# EasyEDA Pro project ProPrj_M0G3507小车_2025-04-02 2025-7-14 232358 6.epro

# Schematic M0G3507电赛控制板
Create Date: 2024-07-20; Page Name: P1; Project Name: M0G3507小车; Schematic Name: M0G3507电赛控制板; Update Date: 2024-07-22; Company: 嘉立创EDA; Page Size: A4; Version: V1.0
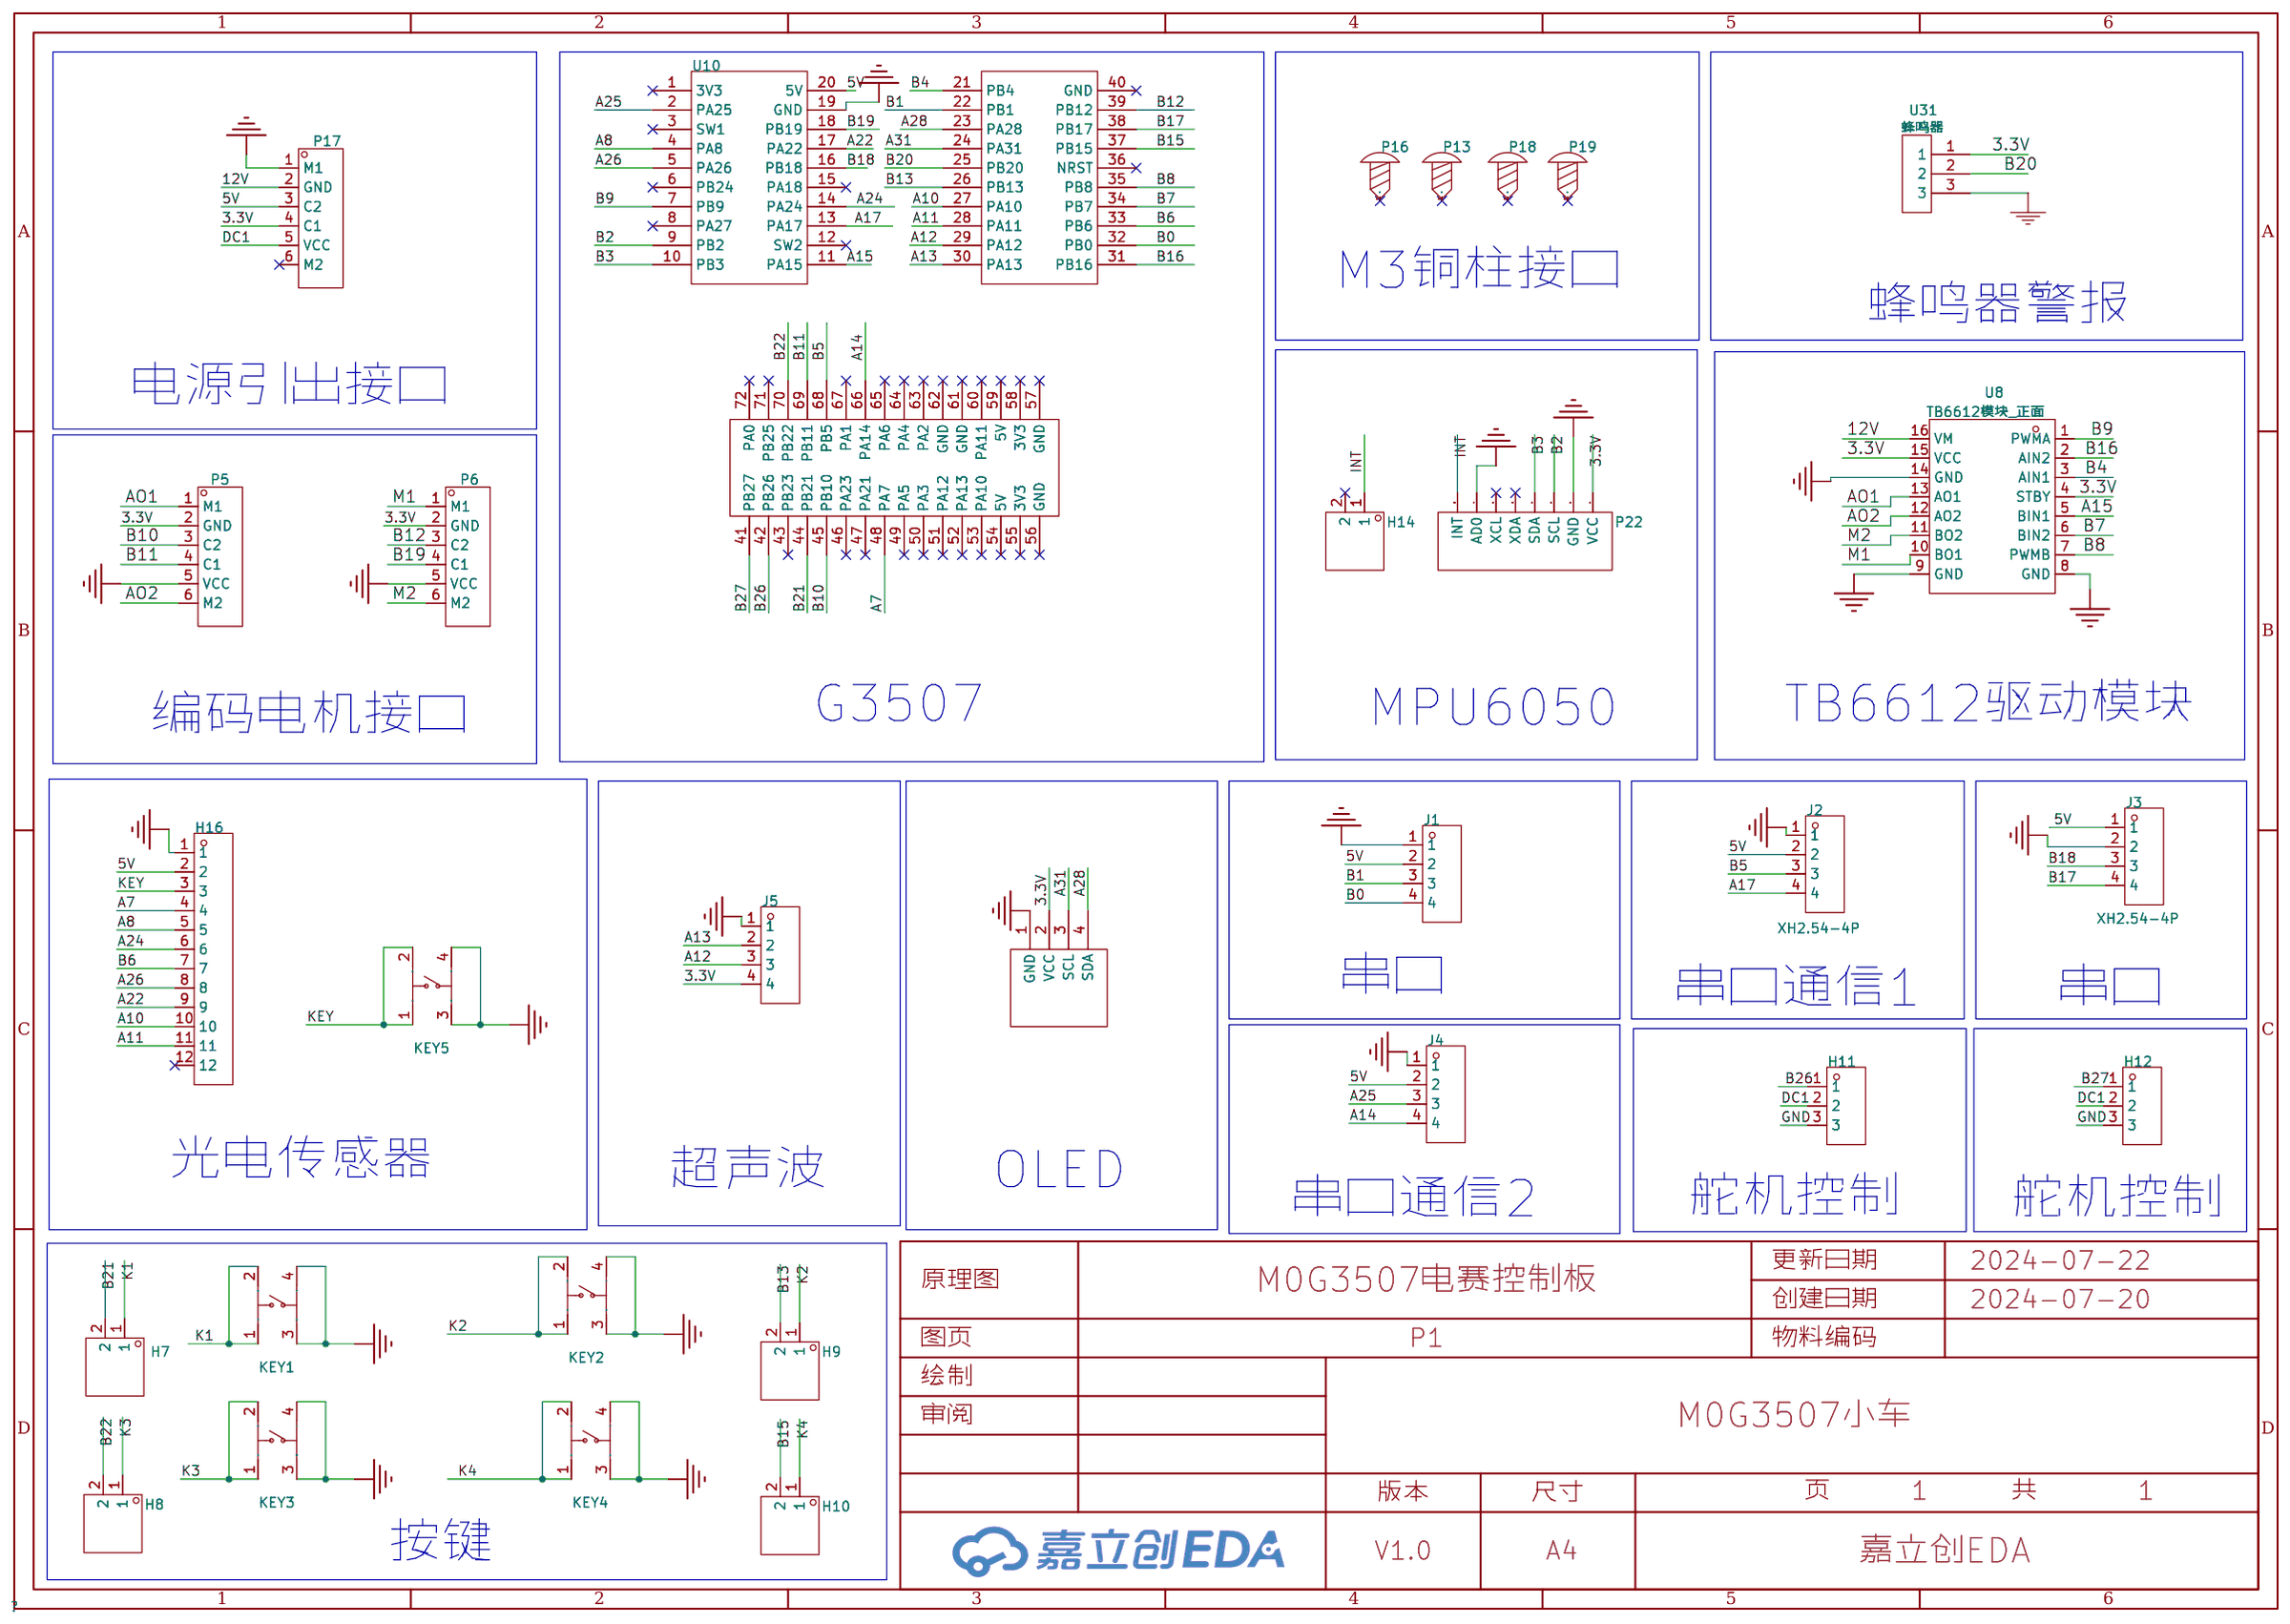
[diagram p0: schematic sheet]

## Parts
H7  -  [HDR-TH_2P-P2.54-V-M-1]
H8  -  [HDR-TH_2P-P2.54-V-M-1]
H9  -  [HDR-TH_2P-P2.54-V-M-1]
H10  -  [HDR-TH_2P-P2.54-V-M-1]
H11  2.54-1*3P正弯针  [3P排针座]
H12  2.54-1*3P正弯针  [3P排针座]
H14  -  [HDR-TH_2P-P2.54-V-M-1]
H16  PZ254V-11-12P  [HDR-TH_12P-P2.54-V-M]
J1  XH2.54-4P  [CONN-TH_4P-P2.50-XH2.54-4P]
J2  XH2.54-4P  [CONN-TH_4P-P2.50-XH2.54-4P]
J3  XH2.54-4P  [CONN-TH_4P-P2.50-XH2.54-4P]
J4  XH2.54-4P  [CONN-TH_4P-P2.50-XH2.54-4P]
J5  XH2.54-4P  [CONN-TH_4P-P2.50-XH2.54-4P]
KEY1  TC-6610-9-260G  [SW-TH_4P-L5.0-W5.0-P4.50-LS6.5]
KEY2  TC-6610-9-260G  [SW-TH_4P-L5.0-W5.0-P4.50-LS6.5]
KEY3  TC-6610-9-260G  [SW-TH_4P-L5.0-W5.0-P4.50-LS6.5]
KEY4  TC-6610-9-260G  [SW-TH_4P-L5.0-W5.0-P4.50-LS6.5]
KEY5  TC-6610-9-260G  [SW-TH_4P-L5.0-W5.0-P4.50-LS6.5]
P5  2.54pitch 6P  [footprint_2943]
P6  2.54pitch 6P  [footprint_2943]
P13  -  [M3螺丝]
P16  -  [M3螺丝]
P17  2.54pitch 6P  [footprint_2943]
P18  -  [M3螺丝]
P19  -  [M3螺丝]
P22  MPU6050模块  [MPU6050模块]
U8  TB6612模块_正面  [footprint_e1ec]
U10  -  [mspm0g3507]
U31  蜂鸣器  [footprint_f32e]
U33  0.96寸OLED  [0.96寸OLED]

## Library data of the parts
H7-H10 H14 = 2.54-1*2P-排针: 间距:2.54mm;总PIN位数:2;排数:1;插针结构:1x2P;行距:-;安装类型:直插;圆针/方针:-;额定电流:-;额定电压:-;配合针长度:6mm;塑高:2.54mm;端接针长度:3mm;触头材质:黄铜;触头镀层:-;工作温度范围:-40℃~+105℃;颜色:黑色;; LCSC Part Name: 2.54mm 1x2P; Supplier Part: C124375; Manufacturer: Ckmtw(灿科盟); Manufacturer Part: B-2100S02P-A110; Supplier Footprint: 插件,P=2.54mm; JLCPCB Part Class: 扩展库; Datasheet: https://atta.szlcsc.com/upload/public/pdf/source/20170821/C124375_1503303305760901527.pdf; Supplier: LCSC; Pitch: 2.54mm; Number of Pins: 2; Number of Rows: 1; Pin Structure: 1x2P; Mounting Type: 直插; Length of Mating Pin: 6mm; Insulation Height: 2.54mm; Length of End Connection Pin: 3mm; Contact Material: 黄铜; Operating Temperature Range: -40℃~+105℃; Color: 黑色
H11 H12 = 2.54-1*3P排针座: LCSC Part Name: 2.54mm 1x3P 弯插 方针; Supplier Part: C92159; Manufacturer: BOOMELE(博穆精密); Supplier Footprint: 插件,P=2.54mm; JLCPCB Part Class: 扩展库; Datasheet: https://atta.szlcsc.com/upload/public/pdf/source/20181121/C2334_B051029C4931EB562F9DCCAAD18AC88A.pdf; Supplier: LCSC; Pitch: 2.54mm; Number of Pins: 3; Number of Rows: 1; Pin Structure: 1x3P; Mounting Type: 弯插; Circluar Pins/Square Pins: 方针; Current Rating (Max): 3A; Length of Mating Pin: 3mm; Insulation Height: 2.54mm; Operating Temperature Range: -55℃~+105℃; Color: 黑色
H16 = 1*12P排针: 插针结构:1x12P;间距:2.54mm;行距:-;圆针/方针:方针;安装类型:直插;排数:单排;总PIN位数:12P;额定电流:3A;额定电压:250V;配合针长度:6mm;塑高:2.5mm;端接针长度:3mm;触头材质:-;工作温度范围:-40℃~+105℃;颜色:黑色;; LCSC Part Name: 间距:2.54mm 1x12P 直插 方针; Supplier Part: C2840012; Manufacturer: XFCN(兴飞); Supplier Footprint: 插件,P=2.54mm; JLCPCB Part Class: 扩展库; Datasheet: https://atta.szlcsc.com/upload/public/pdf/source/20200309/C492403_F9F19131791D08044AD4F84F8E751A34.pdf; Supplier: LCSC; Pin Structure: 1x12P; Pitch: 2.54mm; Circluar Pins/Square Pins: 方针; Mounting Type: 直插; Number of Rows: 单排; Number of Pins: 12P; Current Rating (Max): 3A; Voltage Rating (Max): 250V; Length of Mating Pin: 6mm; Insulation Height: 2.5mm; Length of End Connection Pin: 3mm; Operating Temperature Range: -40℃~+105℃; Color: 黑色
J1-J5 = XH2.54-4P: Supplier: LCSC; Supplier Part: C9900003933; JLCPCB Part Class: 扩展库
KEY1-KEY5 = TC-6610-9-260G: 电路结构:单刀单掷;按钮形状:-;作用力:260gf;安装方式:直插;开关长度:6mm;开关宽度:6mm;开关高度:9mm;带支架:-;触点电流:50mA;额定电压(AC):-;额定电压(DC):12V;额定功率:-;绝缘电阻:100MΩ;带灯:-;机械寿命:10万次;; LCSC Part Name: 6*6*9mm 立贴 轻触开关; Supplier Part: C2845257; Manufacturer: HCTL(华灿天禄); Supplier Footprint: 插件; JLCPCB Part Class: 扩展库; Datasheet: https://atta.szlcsc.com/upload/public/pdf/source/20230323/2FDB5D6FCE87B7593CD3E5FAC75F65D7.pdf; Supplier: LCSC; Circuit: 单刀单掷; Operating Force: 260gf; Mounting Style: 直插; Switch Length: 6mm; Switch Width: 6mm; Switch Height: 9mm; Contact Current: 50mA; Voltage Rating (DC): 12V; Insulation Resistance: 100MΩ; Mechanical Life: 10万次
P5 P6 P17 = 2.54pitch 6P: Supplier: LCSC; Manufacturer: BOOMELE(博穆精密); Manufacturer Part: 杜邦2.54-6A弯针; Supplier Part: C24361; JLCPCB Part Class: Extended Part
P13 P16 P18 P19 = M3螺丝: Supplier Footprint: 插件; Check: false
P22 = MPU6050模块: _: 3
U8 = TB6612模块_正面
U10 = mspm0g3507底座
U31 = 蜂鸣器
U33 = 0.96寸OLED: _: undefined

## Nets
3.3V: J5.4 P5.2(GND) P6.2(GND) P17.4(C1) P22.1(VCC) U8.4(STBY) U8.15(VCC) U31.1 U33.2(VCC)
5V: H16.2 J1.2 J2.2 J3.1 J4.2 P17.3(C2) U10.20(5V)
12V: P17.2(GND) U8.16(VM)
GND: H11.3 H12.3 H16.1 J1.1 J2.1 J3.2 J4.1 J5.1 KEY1.3 KEY1.4 KEY2.3 KEY2.4 KEY3.3 KEY3.4 KEY4.3 KEY4.4 KEY5.3 KEY5.4 P5.5(VCC) P6.5(VCC) P17.1(M1) P22.2(GND) P22.7(AD0) U8.8(GND) U8.9(GND) U8.14(GND) U10.19(GND) U31.3 U33.1(GND)
A7: H16.4 U10.48(PA7)
A8: H16.5 U10.4(PA8)
A10: H16.10 U10.27(PA10)
A11: H16.11 U10.28(PA11)
A12: J5.3 U10.29(PA12)
A13: J5.2 U10.30(PA13)
A14: J4.4 U10.66(PA14)
A15: U8.5(BIN1) U10.11(PA15)
A17: J2.4 U10.13(PA17)
A22: H16.9 U10.17(PA22)
A24: H16.6 U10.14(PA24)
A25: J4.3 U10.2(PA25)
A26: H16.8 U10.5(PA26)
A28: U10.23(PA28) U33.4(SDA)
A31: U10.24(PA31) U33.3(SCL)
AO1: P5.1(M1) U8.13(AO1)
AO2: P5.6(M2) U8.12(AO2)
B0: J1.4 U10.32(PB0)
B1: J1.3 U10.22(PB1)
B2: P22.3(SCL) U10.9(PB2)
B3: P22.4(SDA) U10.10(PB3)
B4: U8.3(AIN1) U10.21(PB4)
B5: J2.3 U10.68(PB5)
B6: H16.7 U10.33(PB6)
B7: U8.6(BIN2) U10.34(PB7)
B8: U8.7(PWMB) U10.35(PB8)
B9: U8.1(PWMA) U10.7(PB9)
B10: P5.3(C2) U10.45(PB10)
B11: P5.4(C1) U10.69(PB11)
B12: P6.3(C2) U10.39(PB12)
B13: H9.2 U10.26(PB13)
B15: H10.2 U10.37(PB15)
B16: U8.2(AIN2) U10.31(PB16)
B17: J3.4 U10.38(PB17)
B18: J3.3 U10.16(PB18)
B19: P6.4(C1) U10.18(PB19)
B20: U10.25(PB20) U31.2
B21: H7.2 U10.44(PB21)
B22: H8.2 U10.70(PB22)
B26: H11.1 U10.42(PB26)
B27: H12.1 U10.41(PB27)
DC1: H11.2 H12.2 P17.5(VCC)
INT: H14.1 P22.8(INT)
K1: H7.1 KEY1.1 KEY1.2
K2: H9.1 KEY2.1 KEY2.2
K3: H8.1 KEY3.1 KEY3.2
K4: H10.1 KEY4.1 KEY4.2
KEY: H16.3 KEY5.1 KEY5.2
M1: P6.1(M1) U8.10(BO1)
M2: P6.6(M2) U8.11(BO2)

Not connected (* = marked no-connect by the designer): H14 2*; H16 12*; P13 1*; P16 1*; P17 6(M2)*; P18 1*; P19 1*; P22 5(XDA)* 6(XCL)*; U10 1(3V3)* 3(SW1)* 6(PB24)* 8(PA27)* 12(SW2)* 15(PA18)* 36(NRST)* 40(GND)* 43(PB23)* 46(PA23)* 47(PA21)* 49(PA5)* 50(PA3)* 51(PA12)* 52(PA13)* 53(PA10)* 54(5V)* 55(3V3)* 56(GND)* 57(GND)* 58(3V3)* 59(5V)* 60(PA11)* 61(GND)* 62(GND)* 63(PA2)* 64(PA4)* 65(PA6)* 67(PA1)* 71(PB25)* 72(PA0)*

## Notes on the sheet
- M3铜柱接口
- 蜂鸣器警报
- 电源引出接口
- G3507
- MPU6050
- TB6612驱动模块
- 编码电机接口
- 串口
- 串口通信1
- 串口
- 光电传感器
- 超声波
- OLED
- 串口通信2
- 舵机控制
- 舵机控制
- 按键

# Board M0G3507电赛控制板
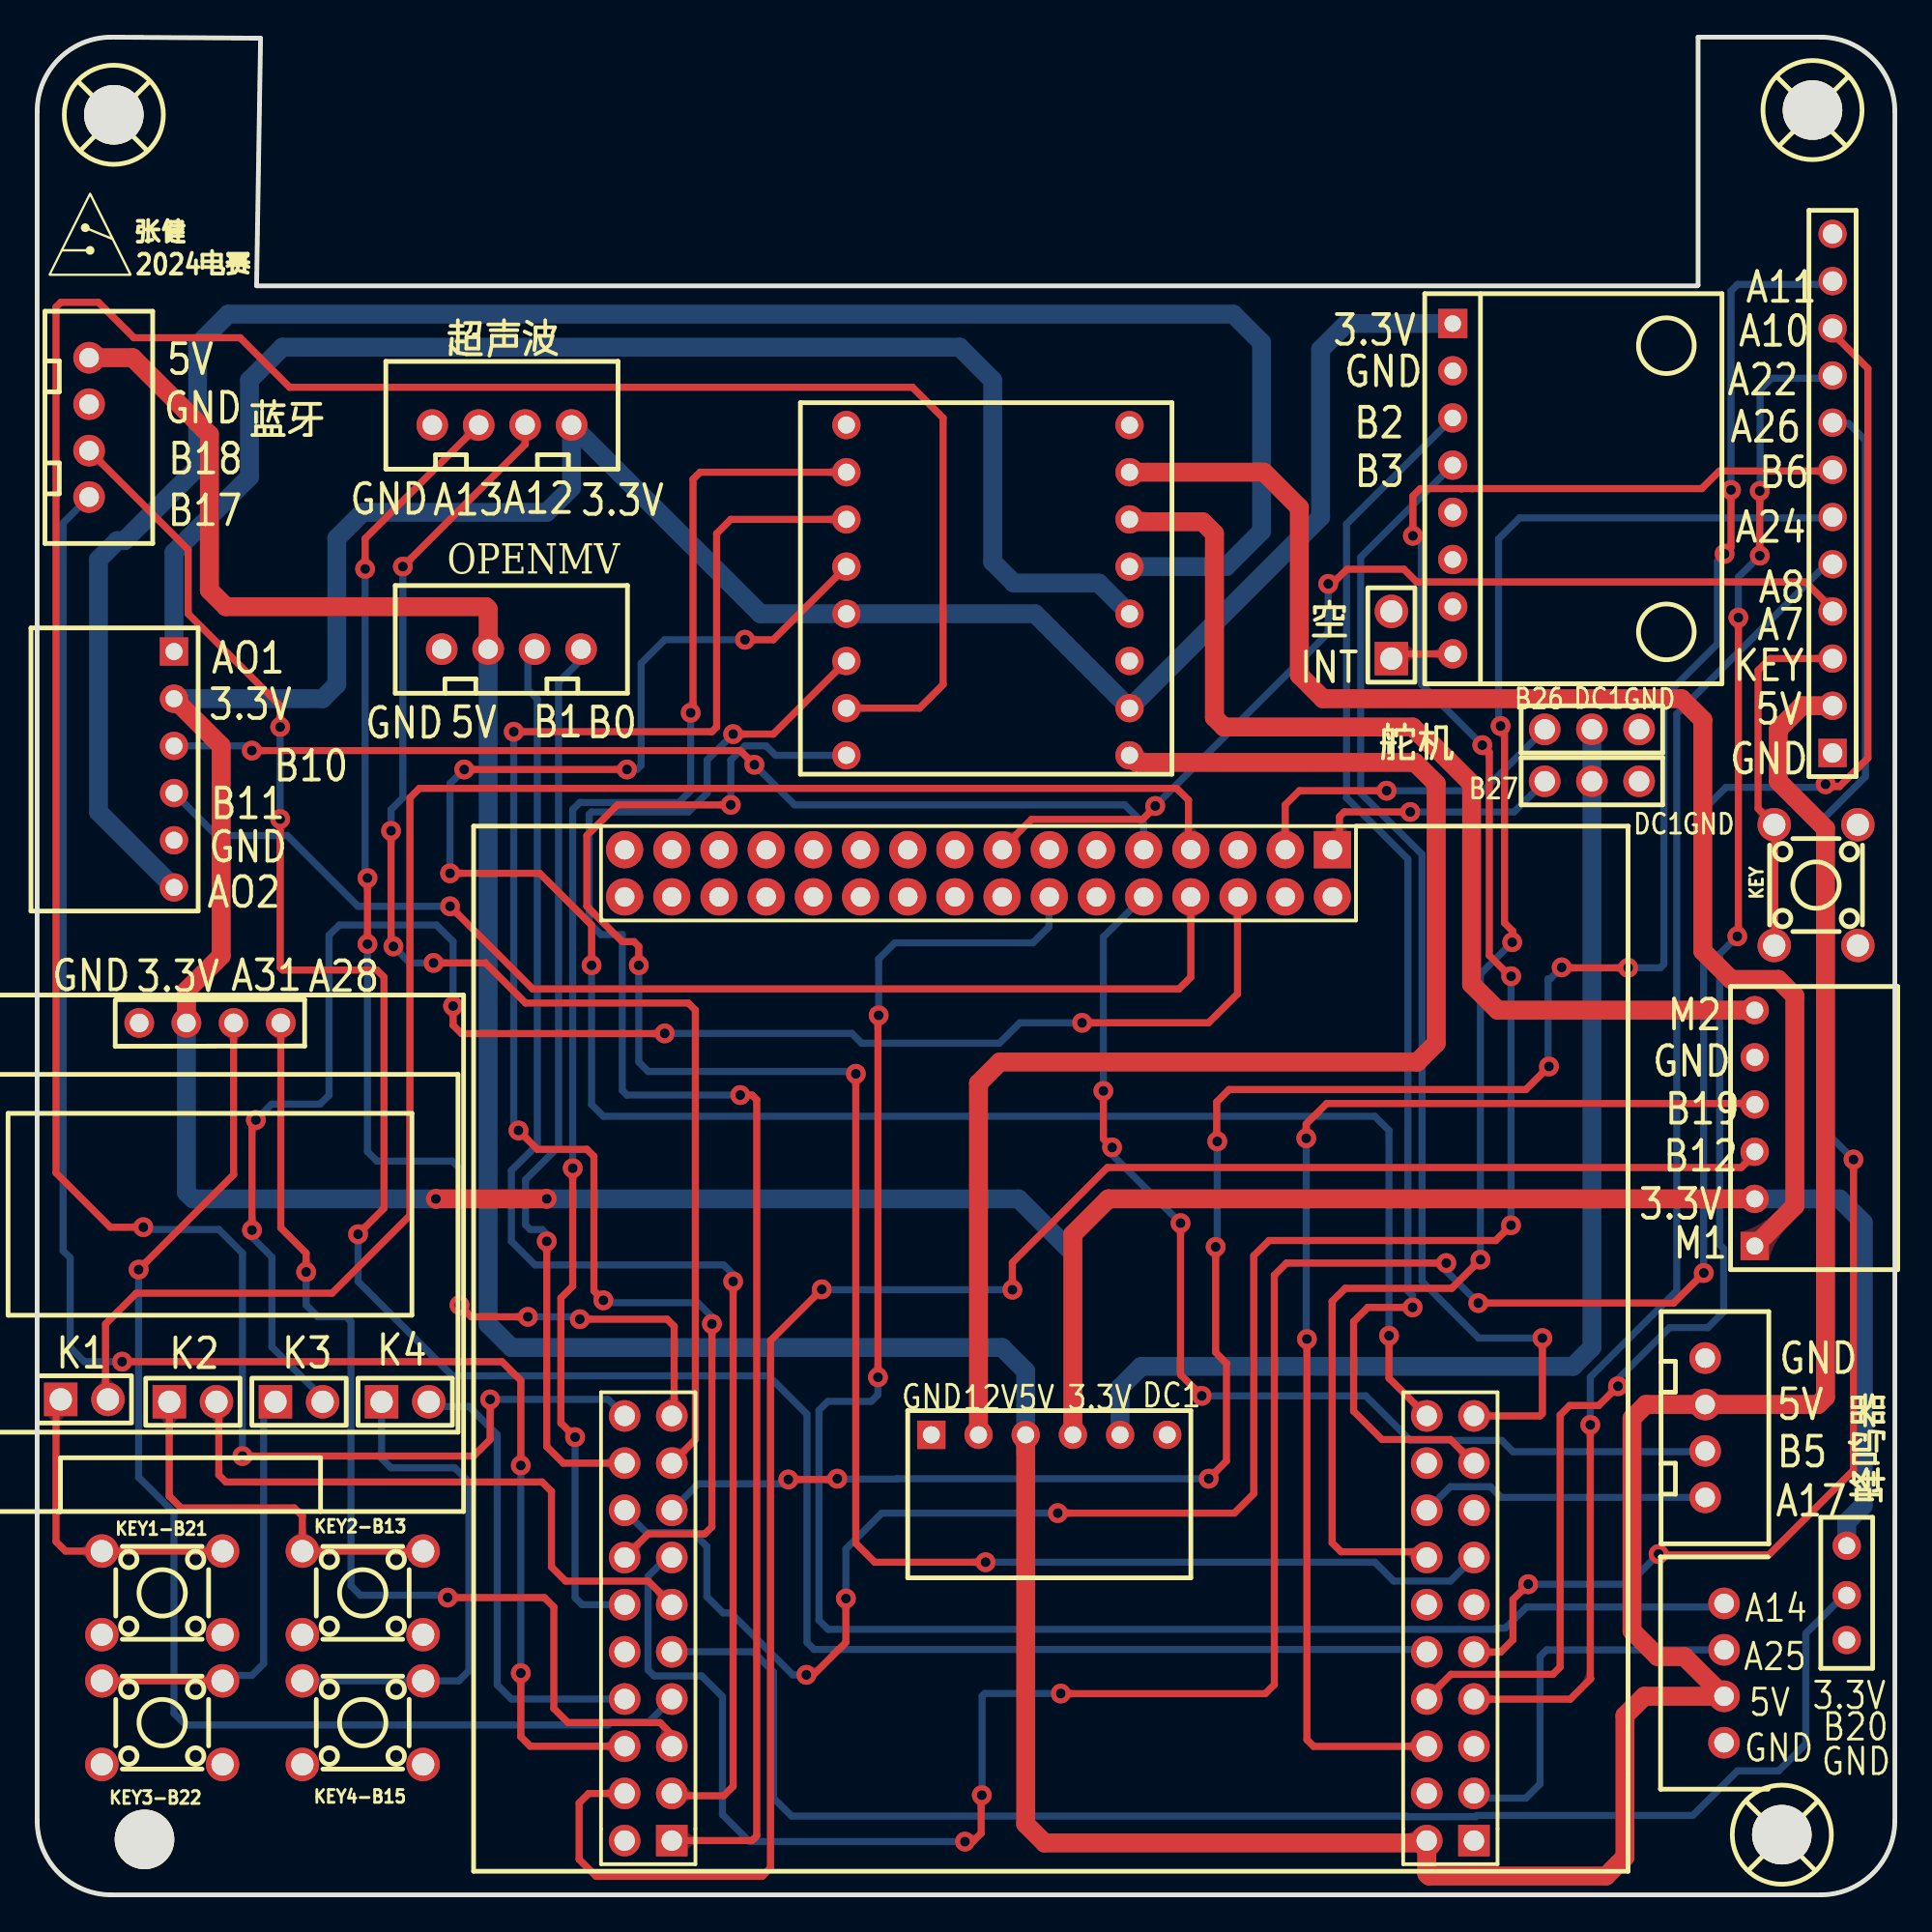
[diagram p1: board, top side]
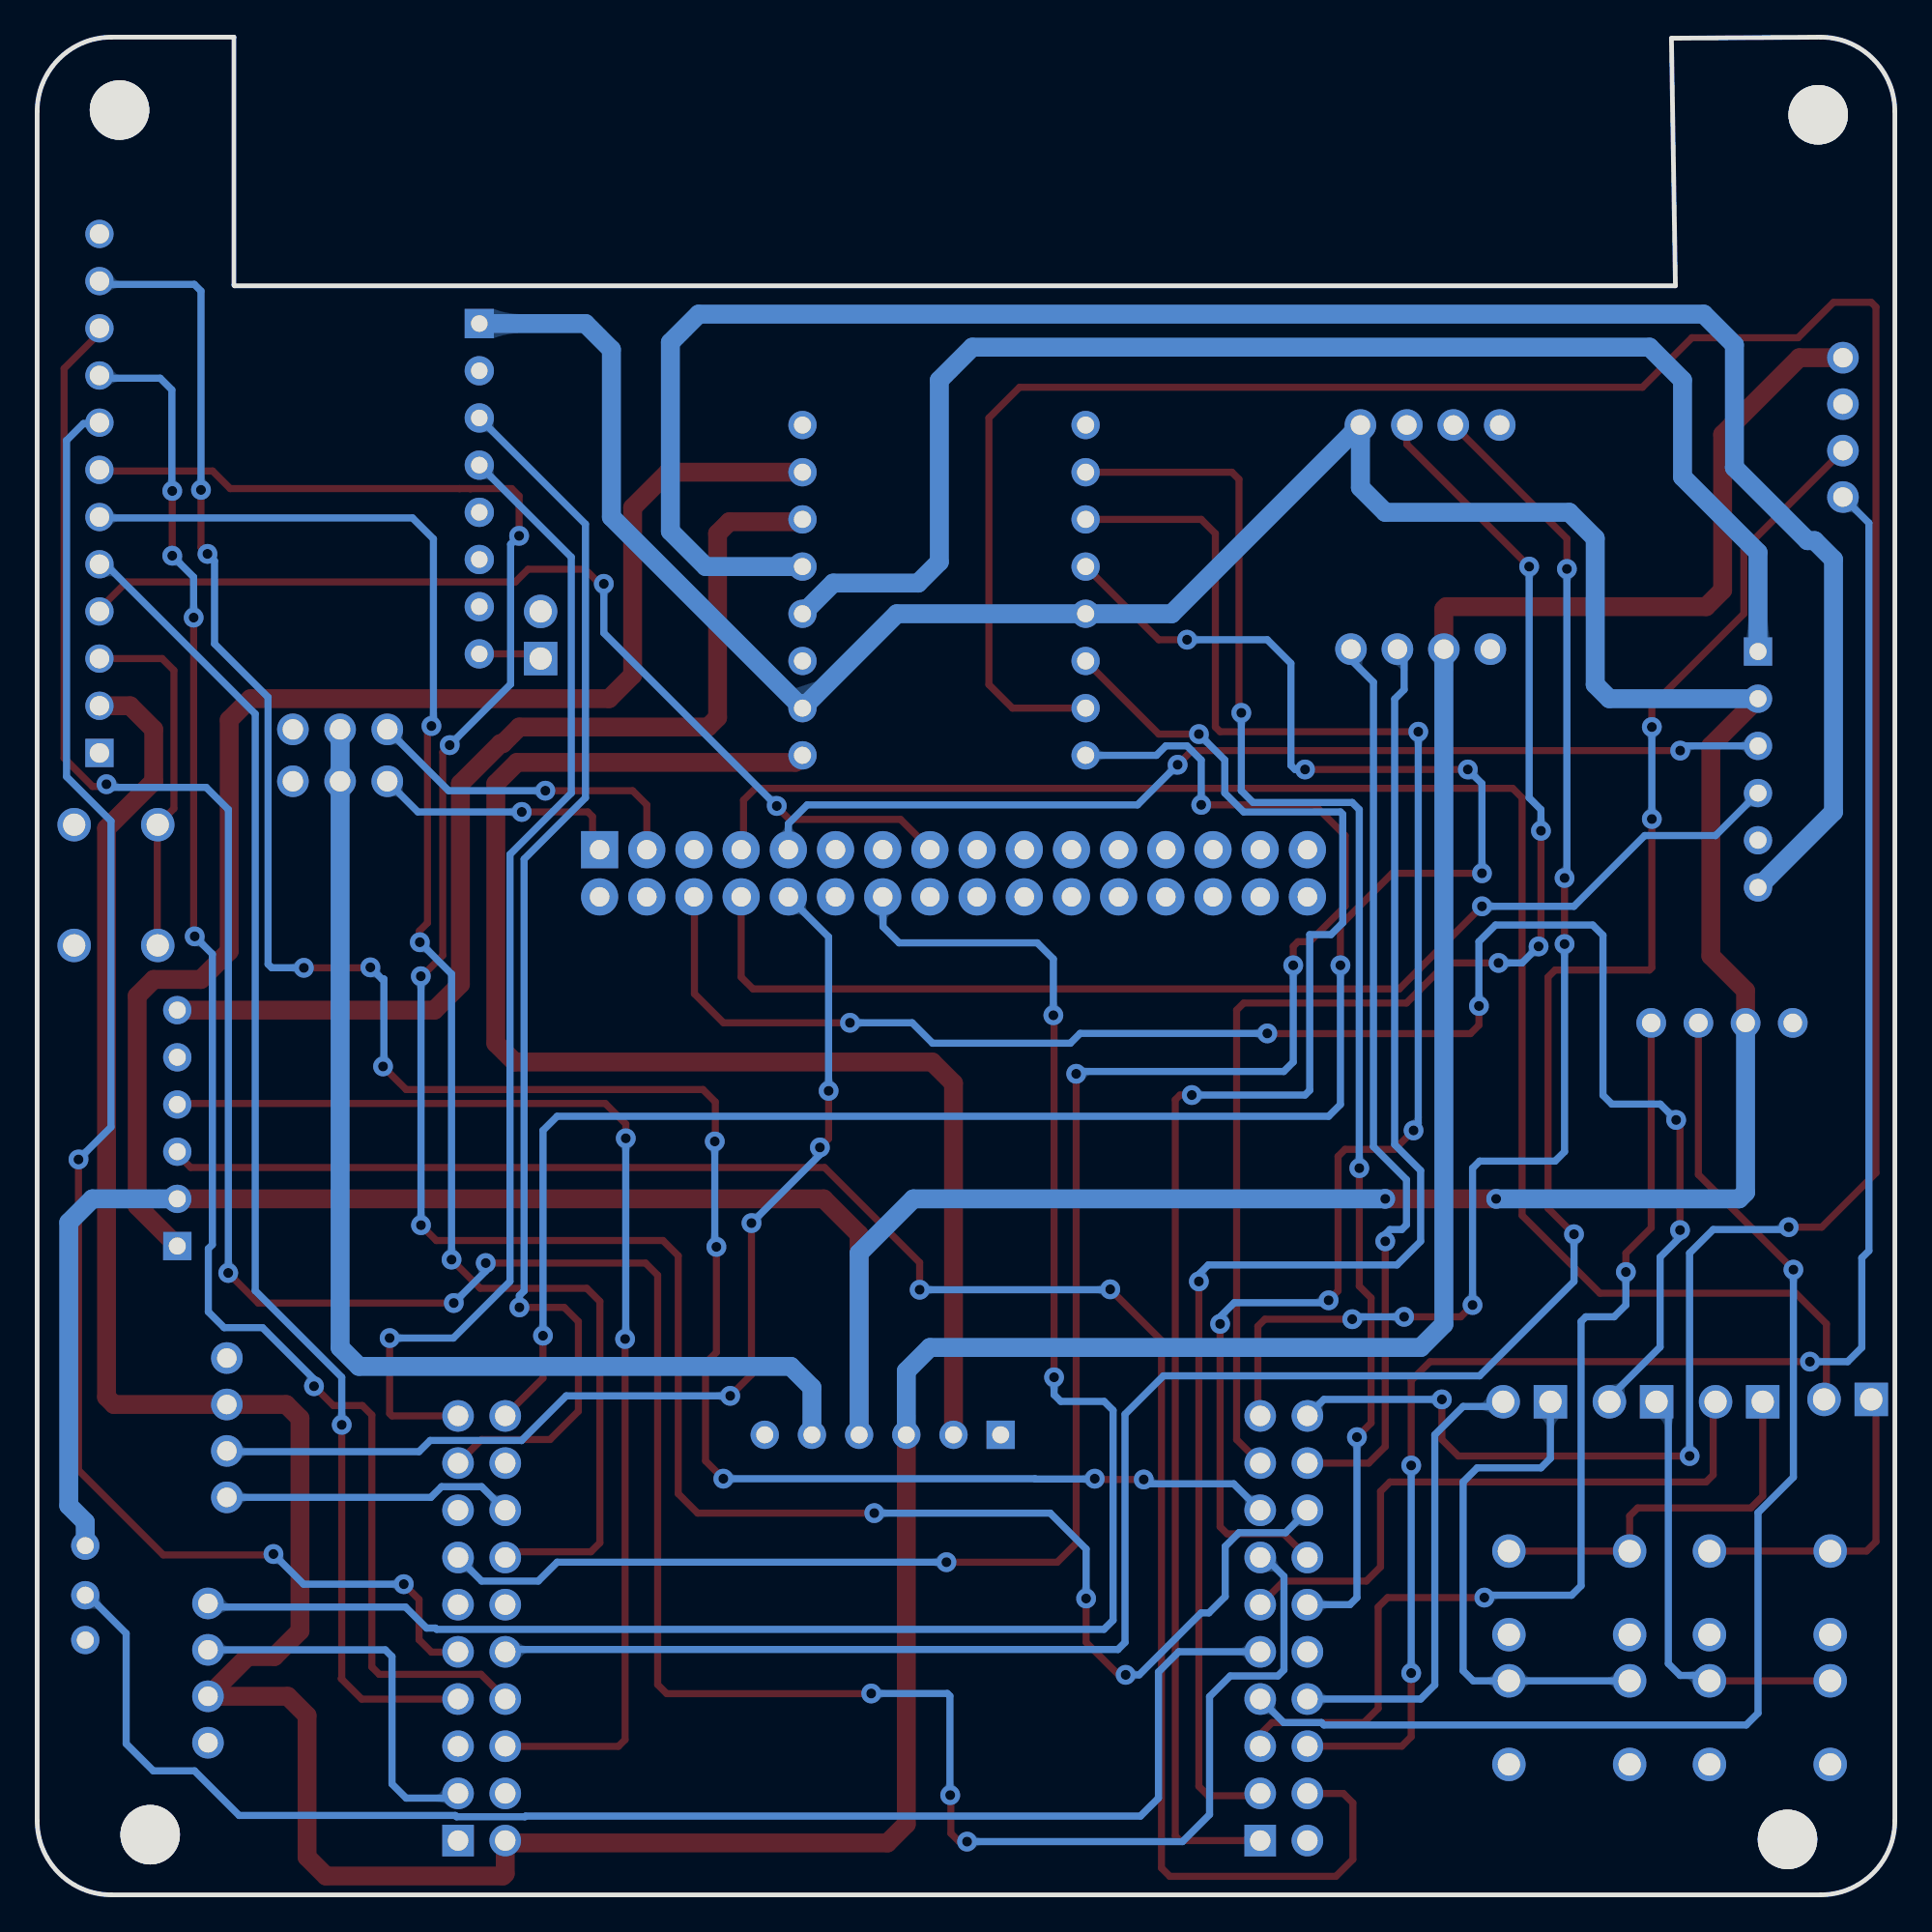
[diagram p2: board, bottom side, seen from below]

Outline 100 x 100 mm; copper layers: Top Layer, Bottom Layer. Coordinates in mm from the lower left corner of the outline.
Outline path: 0,96 0,4 arc(1.17,1.17) 4,0 96,0 arc(98.83,1.17) 100,4 100,96 arc(98.83,98.83) 96,100 89.41,100 89.41,86.65 89.37,86.61 11.81,86.61 12.03,99.94 4,100 arc(1.17,98.83) 0,96
Stack: Top Layer 0.035mm / Dielectric1 1.51mm FR4 er 4.5 / Bottom Layer 0.035mm

## Design rules (mm)
template: JLCPCB Capability(Two Layers Board)
spacing copperThickness1oz (default): track to track 0.102, other pairs 0.152 to 0.3
spacing copperThickness2oz: track to track 0.203, other pairs 0.152 to 0.3
track width copperThickness1oz (default): min 0.127, default 0.254, max 2.54
track width copperThickness2oz: min 0.203, default 0.254, max 2.54
differential pair differentialPair (default): width min 0.127, default 0.254, max 2.54; gap min 0.152, default 0.152
via viaSize (default): diameter min 0.5, default 0.61, max 10; hole min 0.3, default 0.305, max 6.3

## Placement (name value [footprint] x y rotation side)
H7  -  [HDR-TH_2P-P2.54-V-M-1]  2.54 26.67 0 top
H8  -  [HDR-TH_2P-P2.54-V-M-1]  14.1 26.54 0 top
H9  -  [HDR-TH_2P-P2.54-V-M-1]  8.38 26.54 0 top
H10  -  [HDR-TH_2P-P2.54-V-M-1]  19.81 26.54 0 top
H11  2.54-1*3P正弯针  [3P排针座]  83.69 62.74 0 top
H12  2.54-1*3P正弯针  [3P排针座]  83.69 59.94 0 top
H14  -  [HDR-TH_2P-P2.54-V-M-1]  72.9 67.82 90 top
H16  PZ254V-11-12P  [HDR-TH_12P-P2.54-V-M]  96.65 75.44 90 top
J1  XH2.54-4P  [CONN-TH_4P-P2.50-XH2.54-4P]  25.53 67.06 180 top
J2  XH2.54-4P  [CONN-TH_4P-P2.50-XH2.54-4P]  89.79 25.15 90 top
J3  XH2.54-4P  [CONN-TH_4P-P2.50-XH2.54-4P]  2.79 78.99 90 top
J4  XH2.54-4P  [CONN-TH_4P-P2.50-XH2.54-4P]  90.8 11.94 270 top
J5  XH2.54-4P  [CONN-TH_4P-P2.50-XH2.54-4P]  25.02 79.12 180 top
KEY  TC-6610-9-260G  [SW-TH_4P-L5.0-W5.0-P4.50-LS6.5]  95.76 54.36 90 top
KEY1-B21  TC-6610-9-260G  [SW-TH_4P-L5.0-W5.0-P4.50-LS6.5]  6.73 16.26 0 top
KEY2-B13  TC-6610-9-260G  [SW-TH_4P-L5.0-W5.0-P4.50-LS6.5]  17.53 16.26 0 top
KEY3-B22  TC-6610-9-260G  [SW-TH_4P-L5.0-W5.0-P4.50-LS6.5]  6.73 9.27 0 top
KEY4-B15  TC-6610-9-260G  [SW-TH_4P-L5.0-W5.0-P4.50-LS6.5]  17.53 9.27 0 top
P5  2.54pitch 6P  [footprint_2943]  7.37 60.58 270 top
P6  2.54pitch 6P  [footprint_2943]  92.46 41.28 90 top
P13  -  [M3螺丝]  93.98 3.18 0 top
P16  -  [m3螺丝]  5.84 2.92 0 top
P17  2.54pitch 6P  [footprint_2943]  54.48 24.76 0 top
P18  -  [M3螺丝]  4.19 95.76 0 top
P19  -  [M3螺丝]  95.63 96.01 0 top
P22  -  [MPU6050模块]  76.2 66.8 0 top
U8  TB6612模块_正面  [footprint_e1ec]  58.8 60.45 180 top
U10  -  [mspm0g3507]  53.98 13.97 180 top
U31  蜂鸣器  [footprint_f32e]  97.41 16.26 0 top
U33  -  [0.96寸OLED]  9.4 36.07 0 top

## Footprints (pads in the part's own frame, mm; a bottom-side part is the same pattern mirrored in y, then rotated)
0.96寸OLED
  round 1.6 hole 1: 1(-3.903,10.869) 2(-1.363,10.869) 3(1.177,10.869) 4(3.717,10.869)
3P排针座
  round 1.7 hole 1.1: 1(-2.54,0) 2(0,0) 3(2.54,0)
CONN-TH_4P-P2.50-XH2.54-4P
  round 1.7 hole 1.05: 1(3.75,0) 2(1.25,0) 3(-1.25,0) 4(-3.75,0)
footprint_2943
  rect 1.524x1.524 hole 0.914: 1(-6.35,0)
  round 1.524 hole 0.914: 2(-3.81,0) 3(-1.27,0) 4(1.27,0) 5(3.81,0) 6(6.35,0)
footprint_e1ec
  round 1.524 hole 0.919x0.914: 1(15.24,-0.889) 2(15.24,-3.429) 3(15.24,-5.969) 4(15.24,-8.509) 5(15.24,-11.049) 6(15.24,-13.589) 7(15.24,-16.129) 8(15.24,-18.669) 9(0,-18.669) 10(0,-16.129) 11(0,-13.589) 12(0,-11.049) 13(0,-8.509) 14(0,-5.969) 15(0,-3.429) 16(0,-0.889)
footprint_f32e
  round 1.524 hole 0.914: 1(0,2.54) 2(0,-0.127) 3(0,-2.54)
HDR-TH_2P-P2.54-V-M-1
  rect 1.801x1.801 hole 1.199: 1(-1.27,0)
  round 1.801 hole 1.199: 2(1.27,0)
HDR-TH_12P-P2.54-V-M
  rect 1.524x1.524 hole 1.05: 1(-13.97,0)
  round 1.524 hole 1.05: 2(-11.43,0) 3(-8.89,0) 4(-6.35,0) 5(-3.81,0) 6(-1.27,0) 7(1.27,0) 8(3.81,0) 9(6.35,0) 10(8.89,0) 11(11.43,0) 12(13.97,0)
M3螺丝
  round 3.2 hole 3.2: 1(-0.064,0.064)
m3螺丝
  round 3.2 hole 3.2: 1(-0.064,0.064)
MPU6050模块
  rect 1.575x1.575 hole 0.889: 1(0,17.78)
  round 1.575 hole 0.889: 2(0,15.24) 3(0,12.7) 4(0,10.16) 5(0,7.62) 6(0,5.08) 7(0,2.54) 8(0,0)
mspm0g3507
  rect 1.7x1.7 hole 1.1: 1(-23.368,11.049) 21(19.812,11.049)
  round 1.7 hole 1.1: 2(-23.368,8.509) 3(-23.368,5.969) 4(-23.368,3.429) 5(-23.368,0.889) 6(-23.368,-1.651) 7(-23.368,-4.191) 8(-23.368,-6.731) 9(-23.368,-9.271) 10(-23.368,-11.811) 11(-20.828,-11.811) 12(-20.828,-9.271) 13(-20.828,-6.731) 14(-20.828,-4.191) 15(-20.828,-1.651) 16(-20.828,0.889) 17(-20.828,3.429) 18(-20.828,5.969) 19(-20.828,8.509) 20(-20.828,11.049) 22(19.812,8.509) 23(19.812,5.969) 24(19.812,3.429) 25(19.812,0.889) 26(19.812,-1.651) 27(19.812,-4.191) 28(19.812,-6.731) 29(19.812,-9.271) 30(19.812,-11.811) 31(22.352,-11.811) 32(22.352,-9.271) 33(22.352,-6.731) 34(22.352,-4.191) 35(22.352,-1.651) 36(22.352,0.889) 37(22.352,3.429) 38(22.352,5.969) 39(22.352,8.509) 40(22.352,11.049)
  rect 2x2 hole 1.05: 41(-15.748,-42.291)
  round 2 hole 1.05: 42(-13.208,-42.291) 43(-10.668,-42.291) 44(-8.128,-42.291) 45(-5.588,-42.291) 46(-3.048,-42.291) 47(-0.508,-42.291) 48(2.032,-42.291) 49(4.572,-42.291) 50(7.112,-42.291) 51(9.652,-42.291) 52(12.192,-42.291) 53(14.732,-42.291) 54(17.272,-42.291) 55(19.812,-42.291) 56(22.352,-42.291) 57(22.352,-39.751) 58(19.812,-39.751) 59(17.272,-39.751) 60(14.732,-39.751) 61(12.192,-39.751) 62(9.652,-39.751) 63(7.112,-39.751) 64(4.572,-39.751) 65(2.032,-39.751) 66(-0.508,-39.751) 67(-3.048,-39.751) 68(-5.588,-39.751) 69(-8.128,-39.751) 70(-10.668,-39.751) 71(-13.208,-39.751) 72(-15.748,-39.751)
SW-TH_4P-L5.0-W5.0-P4.50-LS6.5
  round 1.8 hole 1.2: 1(-3.25,2.25) 2(3.25,2.25) 3(-3.25,-2.25) 4(3.25,-2.25)

## Nets
As in the schematic, except:
GND: H11.3 H12.3 H16.1 J1.1 J2.1 J3.2 J4.1 J5.1 KEY.3 KEY.4 KEY1-B21.3 KEY1-B21.4 KEY2-B13.3 KEY2-B13.4 KEY3-B22.3 KEY3-B22.4 KEY4-B15.3 KEY4-B15.4 P5.5 P6.5 P17.1 P22.2 P22.7 U8.8 U8.9 U8.14 U10.19 U31.3 U33.1
K1: H7.1 KEY1-B21.1 KEY1-B21.2
K2: H9.1 KEY2-B13.1 KEY2-B13.2
K3: H8.1 KEY3-B22.1 KEY3-B22.2
K4: H10.1 KEY4-B15.1 KEY4-B15.2
KEY: H16.3 KEY.1 KEY.2

Pads without a net: H14 2; H16 12; P13 1; P16 1; P17 6; P18 1; P19 1; P22 5 6; U10 1 3 6 8 12 15 36 40 43 46 47 49 50 51 52 53 54 55 56 57 58 59 60 61 62 63 64 65 67 71 72

## Via types
v1: diameter 1.067, hole 0.533, Top Layer to Bottom Layer, 105 vias

## Routing (per net, layer and track width the routed paths; a pad name or vN(x,y) marks a point on that pad's centre or on a via; arc(x,y) is an arc through that point)
3.3V: length 261.4
  Top Layer w1.016: v1(21.46,37.47) v1(27.43,37.47) ; P17.4 55.75,35.56 57.66,37.47 P6.2 ; P5.2 9.91,61.85 9.91,50.55 8.04,48.67 U33.2
  Bottom Layer w1.016: U31.1 97.41,20.07 98.3,20.96 98.3,36.19 97.03,37.47 P6.2 ; P22.1 70.48,84.58 69.09,83.19 69.09,74.17 U8.15 53.72,68.96 U8.4 38.93,68.96 J5.4 28.77,75.76 27.43,74.42 17.53,74.42 16.13,73.03 16.13,65.15 15.37,64.39 P5.2 ; v1(27.43,37.47) 52.83,37.47 55.75,34.54 P17.4 ; v1(21.46,37.47) 8.38,37.47 8.04,37.81 U33.2
5V: length 242.2
  Top Layer w1.016: J3.1 5.14,82.74 9.27,78.61 9.27,70.23 10.16,69.34 24.15,69.34 24.28,69.22 J1.2 ; P17.3 53.21,3.81 54.23,2.79 74.8,2.79 74.8,1.14 74.93,1.02 84.45,1.02 85.47,2.03 85.47,9.65 86.51,10.69 J4.2 88.67,12.83 87.23,12.83 85.85,14.2 85.85,25.65 86.59,26.4 J2.2 95.86,26.4 96.27,26.8 96.27,57.4 93.73,59.94 93.73,62.74 95,64.01 H16.2
  Bottom Layer w1.016: P17.3 53.21,28.19 51.94,29.46 25.53,29.46 24.28,30.71 J1.2
12V: length 75.6
  Top Layer w1.016: U8.16 59.18,60.96 74.17,60.96 75.31,59.82 75.31,45.85 74.3,44.83 51.82,44.83 50.67,43.69 P17.2
A7: length 53.6
  Top Layer w0.381: 51.88,56.24 53.53,57.89 59.51,57.89 60.19,58.57 v1(60.19,58.62) ; 96.75,69.1 95.19,70.67 74.26,70.67 73.57,71.36 70.5,71.36 69.89,70.74 69.67,70.74 v1(69.5,70.57)
  Bottom Layer w0.381: v1(60.19,58.62) 69.5,67.93 v1(69.5,70.57)
A8: length 72.3
  Top Layer w0.381: v1(83.61,25.3) 83.61,11.66 83.63,11.64 82.53,10.54 77.41,10.54
  Bottom Layer w0.381: 96.6,71.91 88.26,63.57 88.26,32.52 83.61,27.87 v1(83.61,25.3)
A10: length 162.1
  Top Layer w0.381: v1(49.94,2.87) 50.37,2.87 50.81,3.31 50.81,5.33 v1(50.85,5.37) ; v1(89.72,33.48) 88.1,31.86 v1(77.57,31.86) ; v1(55.1,10.84) 55.11,10.83 66.11,10.83 66.6,11.32 66.6,33.36 67.25,34.01 v1(75.85,34.01) ; v1(96.27,59.79) 96.39,59.67 97.02,59.67 98.55,61.2 98.55,82.16 96.39,84.33
  Bottom Layer w0.381: v1(77.57,31.86) 75.85,33.58 v1(75.85,34.01) ; v1(50.85,5.37) 50.87,5.38 50.87,10.7 51,10.84 v1(55.1,10.84) ; v1(49.94,2.87) 38.35,2.87 36.89,4.32 36.89,10.67 35.78,11.78 33.21,11.78 32.89,12.11 32.89,17.15 33.82,18.08 34.22,18.08 ; v1(96.27,59.79) 96.1,59.62 90.9,59.62 89.71,58.42 89.71,33.49 v1(89.72,33.48)
A11: length 124
  Top Layer w0.381: v1(40.43,22.36) 43.03,22.36 v1(43.07,22.4) ; v1(82.06,49.93) 82.09,49.9 v1(85.64,49.9) ; v1(90.83,72.18) 91.18,72.53 v1(91.18,75.63) ; v1(63.44,34.88) 63.44,29.2 64.02,28.62 64.02,23.36 v1(63.06,22.4) ; v1(63.52,40.56) 63.5,40.59 63.5,42.69 64.16,43.35 80.14,43.35 v1(81.38,44.59)
  Bottom Layer w0.381: v1(63.44,34.88) 63.52,34.97 v1(63.52,40.56) ; v1(81.38,44.59) 81.33,44.64 81.33,49.3 81.44,49.3 v1(82.06,49.93) ; 34.14,20.68 35.59,22.13 40.2,22.13 v1(40.43,22.36) ; v1(85.64,49.9) 85.65,49.91 87.38,49.91 87.57,50.1 87.57,64.46 90.45,67.35 90.45,71.8 v1(90.83,72.18) ; 96.63,86.69 91.54,86.69 91.18,86.33 v1(91.18,75.63) 91.16,75.61 ; v1(43.07,22.4) 43.09,22.38 46.27,22.38 46.29,22.4 v1(63.06,22.4)
A12: length 73.7
  Top Layer w0.381: v1(19.69,71.5) 26.27,78.08 J5.3 ; v1(19.18,51.05) 19.05,51.18 v1(19.05,57.28) ; v1(21.34,50.17) 24.13,50.17 26.29,48.01 35.05,48.01 35.43,47.62 35.43,24.51 U10.29
  Bottom Layer w0.381: v1(19.69,71.5) 19.69,59.06 19.05,58.42 v1(19.05,57.28) ; v1(21.34,50.17) 20.07,50.17 v1(19.18,51.05)
A13: length 71.3
  Top Layer w0.381: v1(17.78,54.74) v1(17.78,51.18) ; v1(17.65,71.37) 17.65,73 J5.2 ; v1(26.42,31.12) 23.37,31.12 v1(22.73,31.75) ; U10.30 34.29,25.91 34.29,30.61 33.91,30.99 v1(29.21,30.99)
  Bottom Layer w0.381: v1(17.78,51.18) 17.78,40 18.29,39.5 22.35,39.5 22.73,39.12 v1(22.73,31.75) ; v1(29.21,30.99) 29.08,31.12 v1(26.42,31.12) ; v1(17.65,71.37) 17.65,54.86 v1(17.78,54.74)
A14: length 99.2
  Top Layer w0.381: v1(45.3,47.35) 45.26,47.31 v1(45.26,27.86)
  Bottom Layer w0.381: v1(45.3,47.35) 45.3,50.38 46.16,51.25 53.6,51.25 54.47,52.11 54.47,53.7 ; v1(45.26,27.86) 45.26,26.92 44.9,26.56 42.56,26.56 42.08,26.08 42.08,14.78 42.57,14.29 78.49,14.29 78.56,14.36 79.04,14.36 80.17,15.5 90.8,15.5
A15: length 112.4
  Top Layer w0.381: U8.5 39.62,67.56 v1(38.1,67.56) ; v1(31.75,60.58) v1(22.99,60.58) ; v1(22.23,54.99) 27.05,54.99 29.85,52.2 v1(29.85,50.04) ; U10.11 72.77,27.81 v1(72.77,30.1)
  Bottom Layer w0.381: v1(72.77,30.1) 72.77,41.15 72.01,41.91 30.48,41.91 29.85,42.55 v1(29.85,50.04) ; v1(22.23,54.99) 22.23,59.82 v1(22.99,60.58) ; v1(38.1,67.56) 33.78,67.56 32.51,66.29 32.51,60.8 32.29,60.58 v1(31.75,60.58)
A17: length 15.8
  Bottom Layer w0.381: J2.4 78.81,21.4 78.23,21.97 76.07,21.97 U10.13
A22: length 87.5
  Top Layer w0.381: v1(91.52,51.6) 91.58,51.65 v1(91.58,68.75) ; 92.73,75.57 v1(92.73,72.09) ; v1(85.1,27.38) 84.06,26.34 82.49,26.34 81.98,25.83 81.98,12.27 81.59,11.87 76.11,11.87 74.78,10.54
  Bottom Layer w0.381: v1(92.73,72.09) 91.58,70.93 v1(91.58,68.75) ; 96.53,81.64 93.38,81.64 92.75,81.01 92.75,75.59 v1(92.73,75.57) ; v1(85.1,27.38) 85.1,27.76 87.87,30.53 89.93,30.53 90.79,31.39 90.79,34.78 90.57,35 90.57,50.64 v1(91.52,51.6)
A24: length 85.4
  Top Layer w0.381: v1(77.69,34.19) 76.15,32.65 70.41,32.65 69.71,31.95 69.71,18.95 70.19,18.47 74.49,18.47 74.7,18.25 ; v1(78.78,62.92) 78.99,62.71 78.99,52.32 79.43,51.88 79.43,51.3 v1(79.4,51.28)
  Bottom Layer w0.381: v1(78.78,62.92) 78.67,63.03 78.67,72.99 79.8,74.12 96.52,74.12 ; 77.67,34.18 v1(77.69,34.19) 77.69,49.57 v1(79.4,51.28)
A25: length 20.9
  Bottom Layer w0.381: U10.2 77.6,5.21 80.14,5.21 80.9,5.97 80.9,12.83 81.26,13.19 J4.3
A26: length 85
  Top Layer w0.381: v1(80.26,16.72) 79.44,15.9 79.44,13.73 78.78,13.07 77.33,13.07 ; v1(87.28,18.35) 87.33,18.3 93.21,18.3 97.77,22.86 v1(97.77,39.58)
  Bottom Layer w0.381: v1(97.77,39.58) 96.02,41.33 96.02,57.8 98.42,60.2 98.42,78.29 97.51,79.2 96.74,79.2 ; v1(80.26,16.72) 85.66,16.72 v1(87.28,18.35)
A28: length 57.2
  Top Layer w0.381: v1(14.48,33.53) 14.48,34.54 13.12,35.91 U33.4 ; v1(22.1,16) 27.31,16 27.81,15.49 27.81,10.03 28.58,9.27 33.53,9.27 34.16,8.64 U10.23
  Bottom Layer w0.381: v1(22.1,16) 21.97,16.13 17.4,16.13 16.89,16.64 16.89,30.86 16.64,31.12 15.11,31.12 14.48,31.75 v1(14.48,33.53)
A31: length 67.7
  Top Layer w0.381: U33.3 10.58,38.77 v1(5.46,33.66)
  Bottom Layer w0.381: U10.24 32.89,9.27 30.86,9.27 30.73,9.14 8,9.14 7.37,9.78 7.37,20.57 5.46,22.48 v1(5.46,33.66)
AO1: length 76.1
  Bottom Layer w1.016: U8.13 57.15,70.61 52.58,70.61 51.44,71.75 51.44,81.53 49.66,83.31 13.21,83.31 11.43,81.53 11.43,76.33 7.37,72.26 P5.1
AO2: length 110
  Bottom Layer w1.016: U8.12 64.01,71.5 65.91,73.41 65.91,83.57 64.39,85.09 10.29,85.09 8.64,83.44 8.64,76.83 4.7,72.9 4.32,72.9 3.3,71.88 3.3,58.29 P5.6
B0: length 49.6
  Top Layer w0.381: v1(27.43,35.18) 27.43,24.13 28.32,23.24 U10.32
  Bottom Layer w0.381: v1(27.43,35.18) 27.43,35.56 27.18,35.81 26.54,35.81 26.29,36.07 26.29,38.5 28.07,40.27 28.07,65.28 29.28,66.49 J1.4
B1: length 76.6
  Top Layer w0.381: v1(37.47,33.02) 37.47,5.84 36.96,5.33 34.29,5.33 U10.22
  Bottom Layer w0.381: v1(37.47,33.02) 37.47,33.4 36.96,33.91 26.8,33.91 25.53,35.18 25.53,38.99 26.92,40.39 26.92,64.37 26.42,64.88 26.42,66.69 J1.3
B2: length 67.7
  Top Layer w0.381: v1(74.04,31.62) 71.63,31.62 70.87,30.86 70.87,26.03 72.39,24.51 76.07,24.51 U10.9
  Bottom Layer w0.381: P22.3 70.48,73.79 70.48,59.06 73.79,55.75 73.79,32.51 74.04,32.26 v1(74.04,31.62)
B3: length 62.9
  Top Layer w0.381: U10.10 80.9,25.78 81.03,25.91 v1(81.03,29.97)
  Bottom Layer w0.381: v1(81.03,29.97) 77.6,29.97 74.55,33.02 74.55,56.01 71.25,59.31 71.25,72.01 P22.4
B4: length 86.3
  Top Layer w0.381: U10.21 38.48,2.92 38.73,3.18 38.73,42.8 38.48,43.05 v1(37.85,43.05) ; v1(37.47,62.48) 39.62,62.48 U8.3
  Bottom Layer w0.381: v1(37.85,43.05) 31.75,43.05 31.5,43.31 31.5,51.69 30.35,51.69 29.72,52.32 29.72,58.17 29.85,58.29 35.05,58.29 36.07,59.31 36.07,61.09 v1(37.47,62.48)
B5: length 58
  Top Layer w0.381: v1(57.39,43.28) 57.39,40.7 v1(57.86,40.23) ; v1(61.55,36.16) 61.55,28 v1(62.69,26.86)
  Bottom Layer w0.381: 89.54,23.86 79.45,23.86 78.84,24.46 73.93,24.46 73.92,24.45 71.52,26.86 v1(62.69,26.86) ; v1(57.86,40.23) 57.86,39.84 v1(61.55,36.16) ; 59.51,53.67 57.39,51.56 v1(57.39,43.28)
B6: length 138.1
  Top Layer w0.381: 76.66,75.7 74.46,75.7 74.06,75.3 v1(74.06,73.16) ; 76.66,75.7 76.68,75.68 ; 76.66,75.7 77.26,75.7 ; 77.26,75.7 89.61,75.7 90.56,76.65 96.62,76.65 ; 77.26,75.7 77.26,75.69 ; v1(77.79,61.89) 78.17,61.52 78.17,50.57 79.29,49.45 v1(79.35,49.45) ; v1(79.34,36.05) 78.51,35.22 66.31,35.22 65.49,34.4 65.49,21.59 64.45,20.55 v1(54.94,20.55) ; v1(43.54,15.95) 43.54,13.59 41.78,11.84 v1(41.41,11.84)
  Bottom Layer w0.381: v1(77.79,61.89) 74.51,65.17 74.51,72.7 v1(74.06,73.16) ; v1(54.94,20.55) 45.47,20.55 43.54,18.62 v1(43.54,15.95) ; v1(79.34,36.05) 79.34,49.44 v1(79.35,49.45) ; v1(41.41,11.84) 40.68,11.84 37.34,15.18 36.92,15.18 36.05,16.05 36.05,18.75 35.3,19.5 32.79,19.5 31.59,20.7
B7: length 85.8
  Top Layer w0.381: U10.34 32.89,19.43 35.94,19.43 36.32,19.81 v1(36.32,30.73) ; U8.6 37.34,74.04 36.58,73.28 36.58,62.86 36.32,62.61 v1(25.65,62.61) ; v1(25.91,41.15) 26.92,40.13 29.59,40.13 29.97,39.75 29.97,32.51 v1(30.48,32)
  Bottom Layer w0.381: v1(25.91,41.15) 25.91,41.28 25.65,41.53 v1(25.65,62.61) ; v1(36.32,30.73) 36.32,31.12 35.56,31.88 30.61,31.88 v1(30.48,32)
B8: length 77.8
  Top Layer w0.381: v1(28.96,24.64) 28.19,25.4 28.19,32.13 28.83,32.77 v1(28.83,39.12) ; U8.7 35.69,76.58 35.31,76.2 35.31,63.75 v1(35.18,63.63)
  Bottom Layer w0.381: v1(28.96,24.64) 28.96,16 29.34,15.62 U10.35 ; v1(35.18,63.63) 35.18,59.44 34.54,58.8 29.21,58.8 28.83,58.42 v1(28.83,39.12)
B9: length 103.2
  Top Layer w0.381: v1(51.05,17.91) 45.08,17.91 44.07,18.92 v1(44.07,44.2) ; v1(37.34,58.67) 31.24,58.67 29.59,57.02 29.59,53.21 31.5,51.31 32.13,51.31 32.39,51.05 v1(32.39,50.04)
  Bottom Layer w0.381: v1(37.34,58.67) 37.34,61.09 38.1,61.85 39.24,61.85 39.75,61.34 U8.1 ; v1(32.39,50.04) 32.39,44.83 32.89,44.32 43.94,44.32 v1(44.07,44.2) ; U10.7 76.07,16.89 73.02,16.89 72.01,17.91 v1(51.05,17.91)
B10: length 55.3
  Top Layer w0.381: v1(38.61,60.83) 37.85,61.59 v1(11.56,61.59)
  Bottom Layer w0.381: v1(38.61,60.83) 40.77,58.67 58.55,58.67 59.56,57.66 U10.45 ; P5.3 11.3,61.85 v1(11.56,61.59)
B11: length 63.7
  Top Layer w0.381: U10.69 62.1,49.4 61.47,48.77 26.67,48.77 v1(22.23,53.21)
  Bottom Layer w0.381: v1(22.23,53.21) 17.27,53.21 13.46,57.02 9.65,57.02 P5.4
B12: length 103.1
  Top Layer w0.381: 31.63,5.46 29.69,5.46 29.17,4.95 29.17,1.91 30.09,1 39.03,1 39.48,1.45 39.48,29.84 v1(42.24,32.59) ; v1(52.5,32.57) 52.5,34.04 57.61,39.15 91.73,39.15 92.49,39.91
  Bottom Layer w0.381: v1(52.5,32.57) 42.22,32.57 v1(42.24,32.59)
B13: length 33.6
  Top Layer w0.381: U10.26 32.89,16.89 28.45,16.89 27.69,17.65 27.69,21.72 27.18,22.22 10.16,22.22 9.78,22.61 9.78,26.42 H9.2
B15: length 25.1
  Bottom Layer w0.381: H10.2 21.34,26.29 23.24,26.29 24.77,24.76 24.77,11.3 25.53,10.54 U10.37
B16: length 163.3
  Top Layer w0.381: U8.2 47.5,63.88 48.77,65.15 48.77,79.5 47.12,81.15 13.59,81.15 10.92,83.82 5.21,83.82 3.3,85.72 1.27,85.72 1.02,85.47 1.02,38.86 3.94,35.94 v1(5.72,35.94) ; v1(24.38,26.67) 24.38,24.51 23.5,23.62 v1(11.05,23.62)
  Bottom Layer w0.381: v1(24.38,26.67) 30.73,26.67 U10.31 ; v1(5.72,35.94) 5.84,35.81 9.78,35.81 11.05,34.54 v1(11.05,23.62)
B17: length 96.5
  Top Layer w0.381: U10.38 26.54,8 26.04,8.51 v1(26.04,11.94) ; v1(4.57,28.7) 25.02,28.7 26.04,27.69 v1(26.04,23.11)
  Bottom Layer w0.381: J3.4 1.4,73.85 1.4,34.67 1.78,34.29 1.78,29.46 2.54,28.7 v1(4.57,28.7) ; v1(26.04,23.11) v1(26.04,11.94)
B18: length 127.8
  Top Layer w0.381: v1(17.27,35.56) 18.67,36.96 18.67,49.4 18.29,49.78 13.21,49.78 13.08,49.91 v1(13.08,57.91) ; v1(13.08,62.86) 13.08,64.01 8.13,68.96 8.13,72.41 J3.3
  Bottom Layer w0.381: v1(13.08,62.86) v1(13.08,57.91) ; U10.16 74.68,13.21 41.82,13.21 41.44,13.59 41.44,25.87 39.37,27.94 22.35,27.94 17.27,33.02 v1(17.27,35.56)
B19: length 64.4
  Top Layer w0.381: v1(68.31,40.72) 68.31,40.73 68.31,41.5 69.42,42.6 92.53,42.6 ; v1(68.35,29.92) 68.35,8.35 68.71,7.99 74.79,7.99 74.81,8.01
  Bottom Layer w0.381: v1(68.31,40.72) 68.31,29.96 v1(68.35,29.92)
B20: length 79.5
  Bottom Layer w0.381: 97.23,16.09 97.41,16.14 97.41,16.27 97.23,16.09 ; 97.23,16.09 95.21,14.07 95.21,8.14 93.75,6.67 91.53,6.67 89.13,4.27 77.49,4.27 77.42,4.2 73.74,4.2 73.71,4.24 40.61,4.24 39.64,5.21 39.64,12 38.55,13.09 34.36,13.09
B21: length 90.5
  Top Layer w0.381: U10.44 61.98,56.39 61.98,58.93 61.34,59.56 20.57,59.56 20.07,59.06 20.07,36.58 15.88,32.39 5.33,32.39 3.68,30.73 3.68,26.8 H7.2
B22: length 90.6
  Top Layer w0.381: v1(11.77,41.71) 11.56,41.5 v1(11.56,35.78) ; v1(33.78,46.37) 33.77,46.36 22.85,46.36 22.39,46.82 v1(22.39,47.85) ; v1(56.25,46.94) 63.05,46.94 64.62,48.51 64.62,53.7 64.65,53.74
  Bottom Layer w0.381: v1(11.77,41.71) 12.63,42.57 15.23,42.57 15.71,43.04 15.71,51.65 16.27,52.21 21.5,52.21 22.39,51.31 v1(22.39,47.85) ; v1(11.56,35.78) 11.56,35.4 12.64,34.33 12.64,29.49 15.45,26.67 ; v1(56.25,46.94) 52.9,46.94 51.8,45.84 44.38,45.84 43.86,46.37 v1(33.78,46.37)
B26: length 18.1
  Top Layer w0.381: U10.42 67.18,58.67 67.95,59.44 v1(72.64,59.44)
  Bottom Layer w0.381: H11.1 77.85,59.44 v1(72.64,59.44)
B27: length 13.8
  Top Layer w0.381: U10.41 70.1,56.64 70.1,58.04 70.36,58.29 v1(73.91,58.29)
  Bottom Layer w0.381: H12.1 79.5,58.29 v1(73.91,58.29)
DC1: length 62.1
  Bottom Layer w1.016: H11.2 H12.2 83.69,29.46 82.68,28.45 59.44,28.45 58.29,27.31 P17.5
INT: length 3.2
  Top Layer w0.381: 76.14,66.8 73.33,66.8 73.05,66.53
K1: length 16.9
  Top Layer w0.381: KEY1-B21.2 KEY1-B21.1 1.52,18.51 1.02,19.01 1.02,26.42 H7.1
K2: length 21.1
  Top Layer w0.381: H9.1 7.11,21.46 7.75,20.83 13.84,20.83 14.28,20.4 KEY2-B13.1 KEY2-B13.2
K3: length 23.5
  Top Layer w0.381: KEY3-B22.1 KEY3-B22.2
  Bottom Layer w0.381: H8.1 12.19,25.91 12.19,12.45 11.56,11.81 10.27,11.81 KEY3-B22.2
K4: length 27.6
  Bottom Layer w0.381: H10.1 18.54,23.5 19.05,22.99 22.48,22.99 23.24,22.22 23.24,12.06 22.7,11.52 KEY4-B15.2 KEY4-B15.1
KEY: length 19.7
  Top Layer w0.381: 93.52,57.59 92.64,58.47 92.64,65.92 93.27,66.55 96.67,66.55 ; 93.53,57.7 93.53,51
M1: length 74.4
  Top Layer w1.016: 92.46,34.92 94.61,37.08 94.61,48.39 93.73,49.28 91.19,49.28 89.66,50.8 89.66,63.25 88.52,64.39 69.22,64.39 67.95,65.66 67.95,74.68 66.04,76.58 U8.10
M2: length 56.7
  Top Layer w1.016: U8.11 58.93,73.91 62.74,73.91 63.37,73.28 63.37,63.37 63.88,62.86 74.04,62.86 74.93,61.98 75.06,61.98 77.22,59.82 77.22,49.02 78.61,47.62 P6.6

## Copper pours and planes (outline as drawn; the poured copper is in the pictures)
GND on Top Layer: -5.58,103.07 107.51,103.07 107.51,-4.69 -5.58,-4.69
GND on Bottom Layer: -3.16,100.41 104.12,100.41 104.12,-1.78 -3.16,-1.78

Small or netless copper shapes (teardrops, artwork), in the pictures only: 182 on Top Layer, 171 on Bottom Layer

## Text on the board
Top Silkscreen Layer: B27 | B26 | DC1 | GND | 12V | 5V | 3.3V | A25 | A14 | B20 | K1 | B17 | B18 | K2 | AO2 | B11 | AO1 | A31 | B10 | K3 | A28 | K4 | A13 | A12 | B1 | B0 | INT | B2 | B3 | B12 | B19 | M2 | M1 | A22 | A26 | KEY | A24 | A10 | A11 | A7 | A8 | B6 | A17 | B5 | 张健 / 2024电赛 | 蓝牙 | 超声波 | OPENMV | 空 | 舵机 | 蜂鸣器
